# EAGLE schematic DCCurrent (EAGLE 6.0)
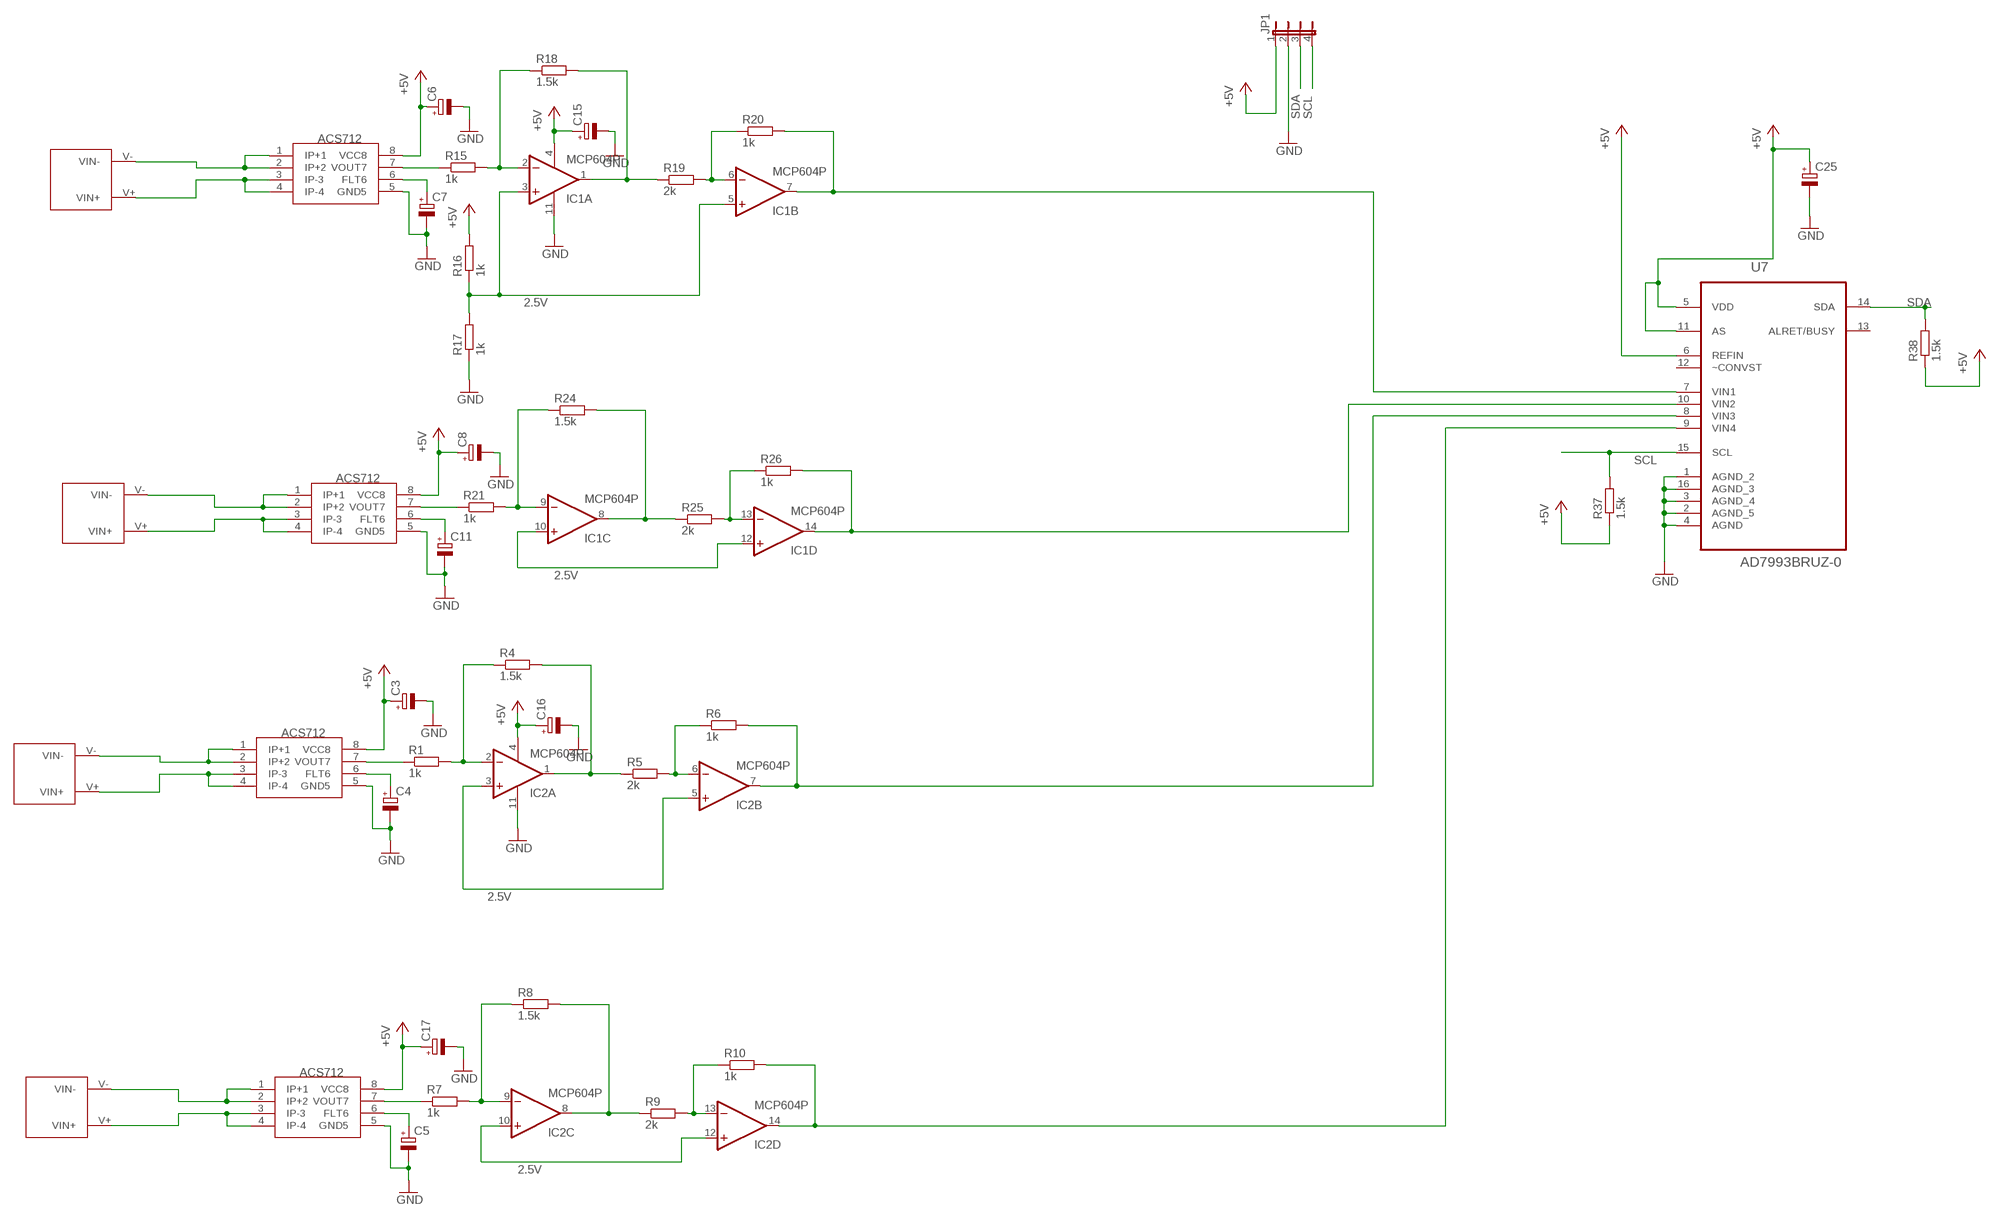
[diagram p0: schematic, sheet 1]

## Parts
C3  CPOL-EUE2-4  [E2-4]
C4  CPOL-EUE2-4  [E2-4]
C5  CPOL-EUE2-4  [E2-4]
C6  CPOL-EUE2-4  [E2-4]
C7  CPOL-EUE2-4  [E2-4]
C8  CPOL-EUE2-4  [E2-4]
C11  CPOL-EUE2-4  [E2-4]
C15  CPOL-EUE2-4  [E2-4]
C16  CPOL-EUE2-4  [E2-4]
C17  CPOL-EUE2-4  [E2-4]
C25  CPOL-EUE2-4  [E2-4]
IC1  MCP604P  [DIL14]
IC2  MCP604P  [DIL14]
JP1  JP4E  [JP4]
R1  1k  R-EU_0309/12  [0309/12]
R4  1.5k  R-EU_0309/12  [0309/12]
R5  2k  R-EU_0309/12  [0309/12]
R6  1k  R-EU_0309/12  [0309/12]
R7  1k  R-EU_0309/12  [0309/12]
R8  1.5k  R-EU_0309/12  [0309/12]
R9  2k  R-EU_0309/12  [0309/12]
R10  1k  R-EU_0309/12  [0309/12]
R15  1k  R-EU_0309/12  [0309/12]
R16  1k  R-EU_0309/12  [0309/12]
R17  1k  R-EU_0309/12  [0309/12]
R18  1.5k  R-EU_0309/12  [0309/12]
R19  2k  R-EU_0309/12  [0309/12]
R20  1k  R-EU_0309/12  [0309/12]
R21  1k  R-EU_0309/12  [0309/12]
R24  1.5k  R-EU_0309/12  [0309/12]
R25  2k  R-EU_0309/12  [0309/12]
R26  1k  R-EU_0309/12  [0309/12]
R37  1.5k  R-EU_0309/12  [0309/12]
R38  1.5k  R-EU_0309/12  [0309/12]
U7  AD7993BRUZ-0  [SOP65P640X120-16N]
U$1  ACS712  [SOIC8]
U$2  INPUT_VOLTAGE_CONNECTOR  [INPUT_VOLTAGE_CONNECTOR]
U$3  INPUT_VOLTAGE_CONNECTOR  [INPUT_VOLTAGE_CONNECTOR]
U$4  ACS712  [SOIC8]
U$5  INPUT_VOLTAGE_CONNECTOR  [INPUT_VOLTAGE_CONNECTOR]
U$6  INPUT_VOLTAGE_CONNECTOR  [INPUT_VOLTAGE_CONNECTOR]
U$9  ACS712  [SOIC8]
U$11  ACS712  [SOIC8]

## Nets
2.5V: IC1.3(A:+IN) IC1.5(B:+IN) IC1.10(C:+IN) IC1.12(D:+IN) IC2.3(A:+IN) IC2.5(B:+IN) IC2.10(C:+IN) IC2.12(D:+IN) R16.1 R17.2
+5V: C3.+ C6.+ C8.+ C15.+ C16.+ C17.+ C25.+ IC1.4(P:V+) IC2.4(P:V+) JP1.1 R16.2 R37.1 R38.1 U7.5(VDD) U7.6(REFIN) U7.11(AS) U$1.8(VCC8) U$4.8(VCC8) U$9.8(VCC8) U$11.8(VCC8)
GND: C3.- C4.- C5.- C6.- C7.- C8.- C11.- C15.- C16.- C17.- C25.- IC1.11(P:V-) IC2.11(P:V-) JP1.2 R17.1 U7.1(AGND_2) U7.2(AGND_5) U7.3(AGND_4) U7.4(AGND) U7.16(AGND_3) U$1.5(GND5) U$4.5(GND5) U$9.5(GND5) U$11.5(GND5)
N$1: U$1.3(IP-3) U$1.4(IP-4) U$6.V+(VIN+)
N$2: U$1.1(IP+1) U$1.2(IP+2) U$6.V-(VIN-)
N$3: R1.1 U$1.7(VOUT7)
N$4: IC2.2(A:-IN) R1.2 R4.1
N$5: C4.+ U$1.6(FLT6)
N$6: IC2.1(A:OUT) R4.2 R5.1
N$7: IC2.6(B:-IN) R5.2 R6.1
N$8: U$4.3(IP-3) U$4.4(IP-4) U$5.V+(VIN+)
N$9: U$4.1(IP+1) U$4.2(IP+2) U$5.V-(VIN-)
N$10: R7.1 U$4.7(VOUT7)
N$11: IC2.9(C:-IN) R7.2 R8.1
N$12: C5.+ U$4.6(FLT6)
N$13: IC2.8(C:OUT) R8.2 R9.1
N$14: U$3.V+(VIN+) U$9.3(IP-3) U$9.4(IP-4)
N$15: IC2.13(D:-IN) R9.2 R10.1
N$16: U$3.V-(VIN-) U$9.1(IP+1) U$9.2(IP+2)
N$19: R15.1 U$9.7(VOUT7)
N$20: IC1.2(A:-IN) R15.2 R18.1
N$22: C7.+ U$9.6(FLT6)
N$25: IC1.6(B:-IN) R19.2 R20.1
N$26: IC1.1(A:OUT) R18.2 R19.1
N$27: U$2.V+(VIN+) U$11.3(IP-3) U$11.4(IP-4)
N$28: U$2.V-(VIN-) U$11.1(IP+1) U$11.2(IP+2)
N$29: R21.1 U$11.7(VOUT7)
N$30: IC1.9(C:-IN) R21.2 R24.1
N$31: C11.+ U$11.6(FLT6)
N$33: IC1.8(C:OUT) R24.2 R25.1
N$34: IC1.13(D:-IN) R25.2 R26.1
SCL: JP1.4 R37.2 U7.15(SCL)
SDA: JP1.3 R38.2 U7.14(SDA)
VAC_OUT1: IC1.7(B:OUT) R20.2 U7.7(VIN1)
VAC_OUT2: IC1.14(D:OUT) R26.2 U7.10(VIN2)
VAC_OUT3: IC2.14(D:OUT) R10.2 U7.9(VIN4)
VAC_OUT4: IC2.7(B:OUT) R6.2 U7.8(VIN3)
Unconnected: U7.12(~CONVST) U7.13(ALRET/BUSY)

## Library data of the parts
C3-C8 C11 C15-C17 C25 = resistor:CPOL-EU: POLARIZED CAPACITOR, European symbol
IC1 IC2 = linear - Power:MCP604: Quad Op Amp 2.7V to 6.0V Single Supply CMOS Source: http://ww1.microchip.com/downloads/en/DeviceDoc/21314g.pdf
JP1 = connectors:JP4E: JUMPER
R1 R4-R10 R15-R21 R24-R26 R37 R38 = resistor:R-EU_: RESISTOR, European symbol
U7 = ADC:AD7993BRUZ-0: ADC; MPN: AD7993BRUZ-0; OC_FARNELL: 1078309; OC_NEWARK: 59K6101; PACKAGE: TSSOP-16; SUPPLIER: Analog Devices
U$1 U$4 U$9 U$11 = Pauls_parts:ACS712
U$2 U$3 U$5 U$6 = ekohub2013:INPUT_VOLTAGE_CONNECTOR